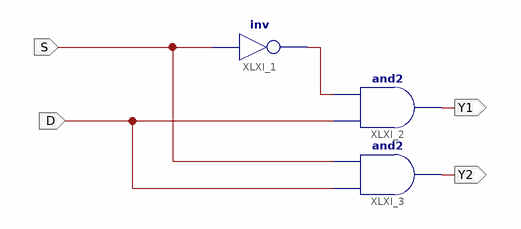
[diagram p0: schematic sheet 1]
// Xilinx ISE schematic demux.sch (spartan6) as structural Verilog: 3 symbols, 4 ports
module demux (
  input  S,
  input  D,
  output Y1,
  output Y2
);

  wire XLXN_1;

  not XLXI_1 (XLXN_1, S);
  and XLXI_2 (Y1, D, XLXN_1);
  and XLXI_3 (Y2, D, S);
endmodule
